# Altium project SoldeerBout.PrjPcb
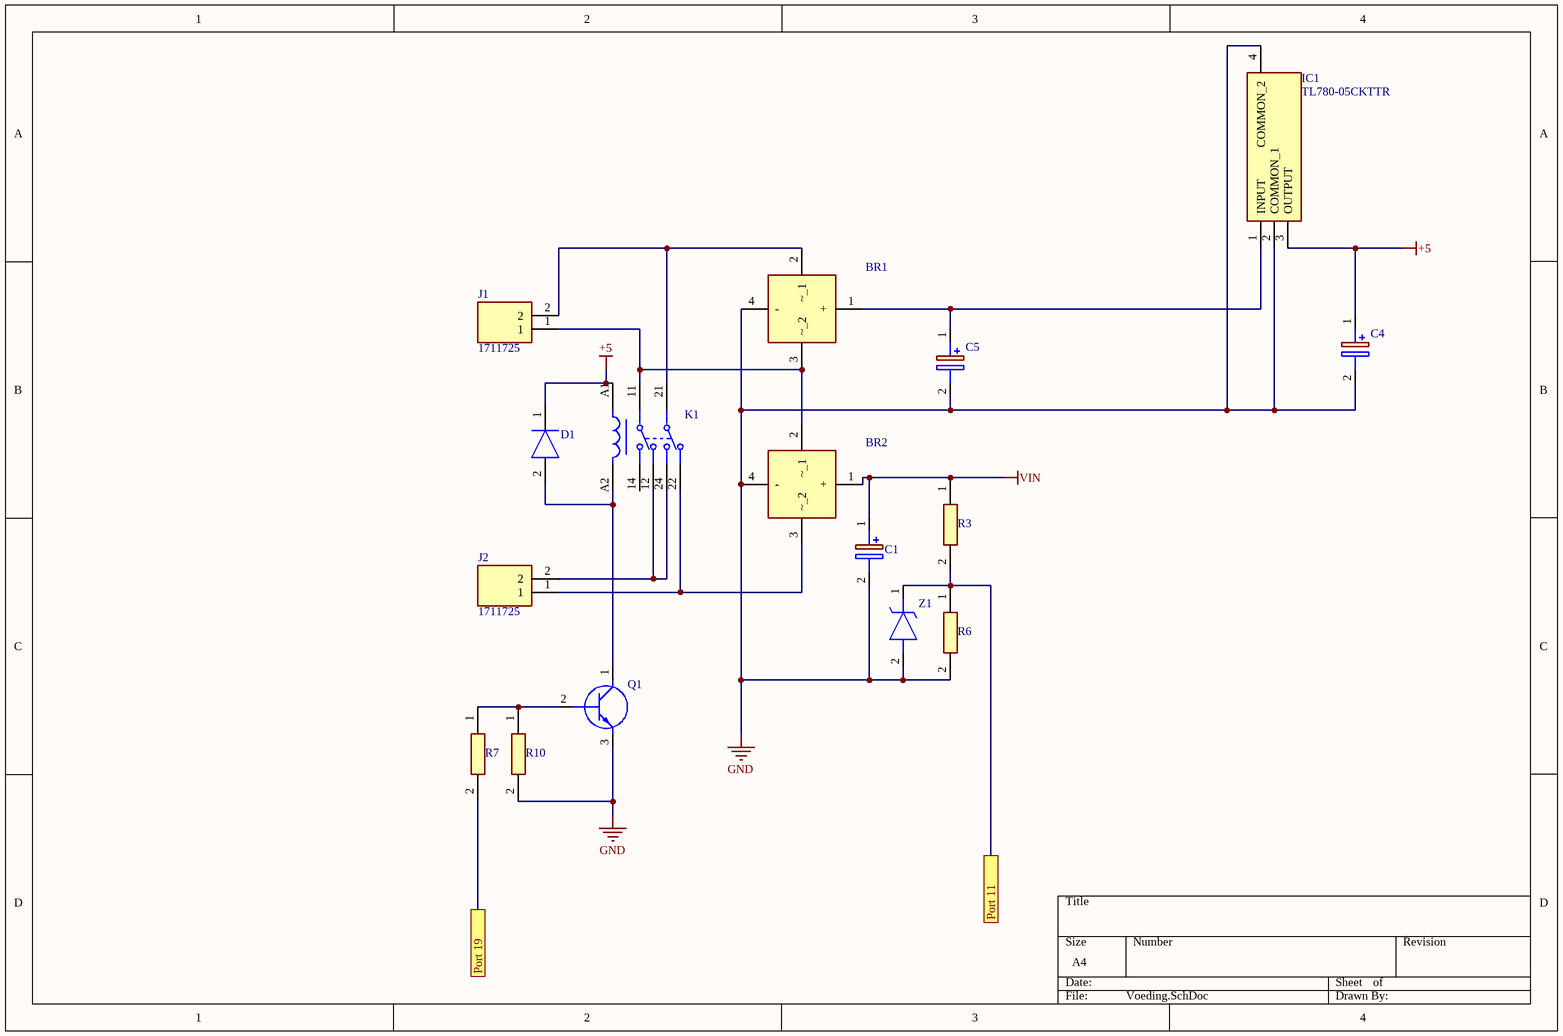
[diagram p0: Voeding.SchDoc]
5 sheets, 76 parts. Net scope: flat (ports and power ports of the same name join across sheets).
Board files: beter.PcbDoc, test.PcbDoc, goodPCB.PcbDoc
Sheets:
  Voeding.SchDoc
  Processor.SchDoc
  Opamp.SchDoc
  Display.SchDoc
  BoutVoeding.SchDoc

## Sheet Voeding.SchDoc
size A4; SheetNumber: 1; SheetTotal: 5

### Parts
BR1  GBU6J-E3_45  [Bridge rectifier]  (value not drawn)
BR2  GBU6J-E3_45  [Bridge rectifier]  (value not drawn)
C1  ESK478M050AQ3AA  [4700µF 50V]  (value not drawn)
C4  EEU-FR1H100  [10µF 50V]  (value not drawn)
C5  EEU-FR1H100  [100µF]  (value not drawn)
D1  1N4007G-T  [D1]  (value not drawn)
IC1  TL780-05CKTTR  [IC1]
J1  1711725  [Phoenix]
J2  1711725  [Phoenix]
K1  RT424615  [FP-RT424615-MFG]  (value not drawn)
Q1  BC547CBU  [TTTT]  (value not drawn)
R3  CRCW080510K0DHEAP  [Resistor]  (value not drawn)
R6  CRCW080510K0DHEAP  [Resistor]  (value not drawn)
R7  CRCW080510K0DHEAP  [Resistor]  (value not drawn)
R10  CRCW08054K70FKEAHP  [Resistor]  (value not drawn)
Z1  SZMMSZ5231BT1G  [Zener]  (value not drawn)

### Ports
Port 11, Port 19

### Nets
+5: C4.1(+) D1.1(K) IC1.3(OUTPUT) K1.A1
GND: BR1.4(-) BR2.4(-) C1.2(-) C4.2(-) C5.2(-) IC1.2(COMMON_1) IC1.4(COMMON_2) Q1.3(E) R6.2 R10.2 Z1.2(A)
VIN: BR2.1(+) C1.1(+) R3.1
NetBR1_1: BR1.1(+) C5.1(+) IC1.1(INPUT)
NetBR1_2: BR1.2(~_1) J1.2 K1.21
NetBR1_3: BR1.3(~_2) BR2.2(~_1) J1.1 K1.11
NetBR2_3: BR2.3(~_2) J2.1 K1.22
NetD1_2: D1.2(A) K1.A2 Q1.1(C)
NetIC3_11: R3.2 R6.1 Z1.1(K) ; port Port 11
NetIC3_19: R7.2 ; port Port 19
NetJ2_2: J2.2 K1.12 K1.24
NetQ1_2: Q1.2(B) R7.1 R10.1

Not connected (* = marked no-connect by the designer): K1 14

### Library data of the parts
BR1 BR2 = GBU6J-E3_45: Bridge Rectifier; Manufacturer_Name: Vishay; Manufacturer_Part_Number: GBU6J-E3/45; Datasheet Link: http://www.vishay.com/docs/88615/gbu6a.pdf; Height: 18.8mm
C1 = ESK478M050AQ3AA: Capacitor Polarised 50V 4700uF; Manufacturer_Name: Kemet; Datasheet Link: https://componentsearchengine.com//ESK478M050AQ3AA.pdf; Height: 37mm; Mouser2 Part Number: 80-ESK478M050AQ3AA; Mouser2 Price/Stock: https://www.mouser.com/Search/Refine.aspx?Keyword=80-ESK478M050AQ3AA; Manufacturer_Part_Number: ESK478M050AQ3AA
C4 C5 = EEU-FR1H100: Capacitor Polarised 50VDC 10uF; Manufacturer_Name: Panasonic; Datasheet Link: https://componentsearchengine.com//EEU-FR1H100.pdf; Height: 12.5mm; Mouser2 Part Number: 667-EEU-FR1H100; Mouser2 Price/Stock: https://www.mouser.com/Search/Refine.aspx?Keyword=667-EEU-FR1H100; Manufacturer_Part_Number: EEU-FR1H100
D1 = 1N4007G-T: Diode; Manufacturer_Name: Diodes Inc.; Datasheet Link: https://componentsearchengine.com//1N4007G-T.pdf; Mouser2 Part Number: 621-1N4007G-T; Mouser2 Price/Stock: https://www.mouser.com/Search/Refine.aspx?Keyword=621-1N4007G-T; Manufacturer_Part_Number: 1N4007G-T
IC1 = TL780-05CKTTR: Integrated Circuit; Manufacturer_Name: Texas Instruments; Datasheet Link: http://www.ti.com/general/docs/suppproductinfo.tsp?distId=26&gotoUrl=http%3A%2F%2Fwww.ti.com%2Flit%2Fgpn%2Ftl780; Height: 5.08mm; Manufacturer_Part_Number: TL780-05CKTTR
J1 J2 = 1711725: Connector; Manufacturer_Name: Phoenix Contact; Datasheet Link: http://www.phoenixcontact.com/de/produkte/1711725/pdf; Height: 18.2mm; Manufacturer_Part_Number: 1711725
K1 = CMP-03395-000241-1: RELAY GEN PURPOSE DPDT 8A 115V; Max Current Rating: 15A; Ratings: IP54; Coil Type: Non-Latching; Power Rating: 760mW; Max Voltage Rating (AC): 400V; Coil Resistance: 8.1kR; Operate Time: 8ms; Approvals: CSA; Application(s): POWER; Relay Type: General Purpose; Switching Capacity: 2kW; Length: 29mm; Switching Current: 8A; Mount: Through Hole; Contact Current Rating: 8A; Coil Voltage (AC): 115V; Voltage Rating (AC): 400V; Width: 12.7mm; Radiation Hardening: No; Case/Package: DIP; Current Rating: 8A; Number of Pins: 8; Height: 15.7mm; Series: RT2, SCHRACK; Throw Configuration: DPDT; Packaging: Rail/Tube; Package Quantity: 500; Min Operating Temperature: -40°C; Termination: PC Pin; RoHS Compliant: Yes; Depth: 12.7mm; Max Operating Temperature: 70°C; Contact Material: Silver
Q1 = BC547CBU: Transistor BJT NPN; Manufacturer_Name: ON Semiconductor; Datasheet Link: https://www.onsemi.com/pdf/datasheet/bc550-d.pdf; Height: 5.33mm; Manufacturer_Part_Number: BC547CBU
R3 = CRCW080510K0DHEAP: Resistor 68KOhm; Manufacturer_Name: Vishay; Datasheet Link: https://www.arrow.com/en/products/crcw080510k0dheap/vishay; Height: 0.5mm; Manufacturer_Part_Number: CRCW080510K0DHEAP
R6 R7 = CRCW080510K0DHEAP: Resistor 10KOhm; Manufacturer_Name: Vishay; Datasheet Link: https://www.arrow.com/en/products/crcw080510k0dheap/vishay; Height: 0.5mm; Manufacturer_Part_Number: CRCW080510K0DHEAP
R10 = CRCW08054K70FKEAHP: Resistor 4.7KOhm; Manufacturer_Name: Vishay; Datasheet Link: https://componentsearchengine.com//CRCW08054K70FKEAHP.pdf; Height: 0.5mm; Mouser2 Part Number: 71-CRCW08054K70FKEAH; Mouser2 Price/Stock: https://www.mouser.com/Search/Refine.aspx?Keyword=71-CRCW08054K70FKEAH; Manufacturer_Part_Number: CRCW08054K70FKEAHP
Z1 = SZMMSZ5231BT1G: Zener Diode; Manufacturer_Name: ON Semiconductor; Datasheet Link: https://componentsearchengine.com//SZMMSZ5231BT1G.pdf; Height: 1.35mm; Mouser2 Part Number: 863-SZMMSZ5231BT1G; Mouser2 Price/Stock: https://www.mouser.com/Search/Refine.aspx?Keyword=863-SZMMSZ5231BT1G; Manufacturer_Part_Number: SZMMSZ5231BT1G

## Sheet Processor.SchDoc
size A4; SheetNumber: 2; SheetTotal: 5
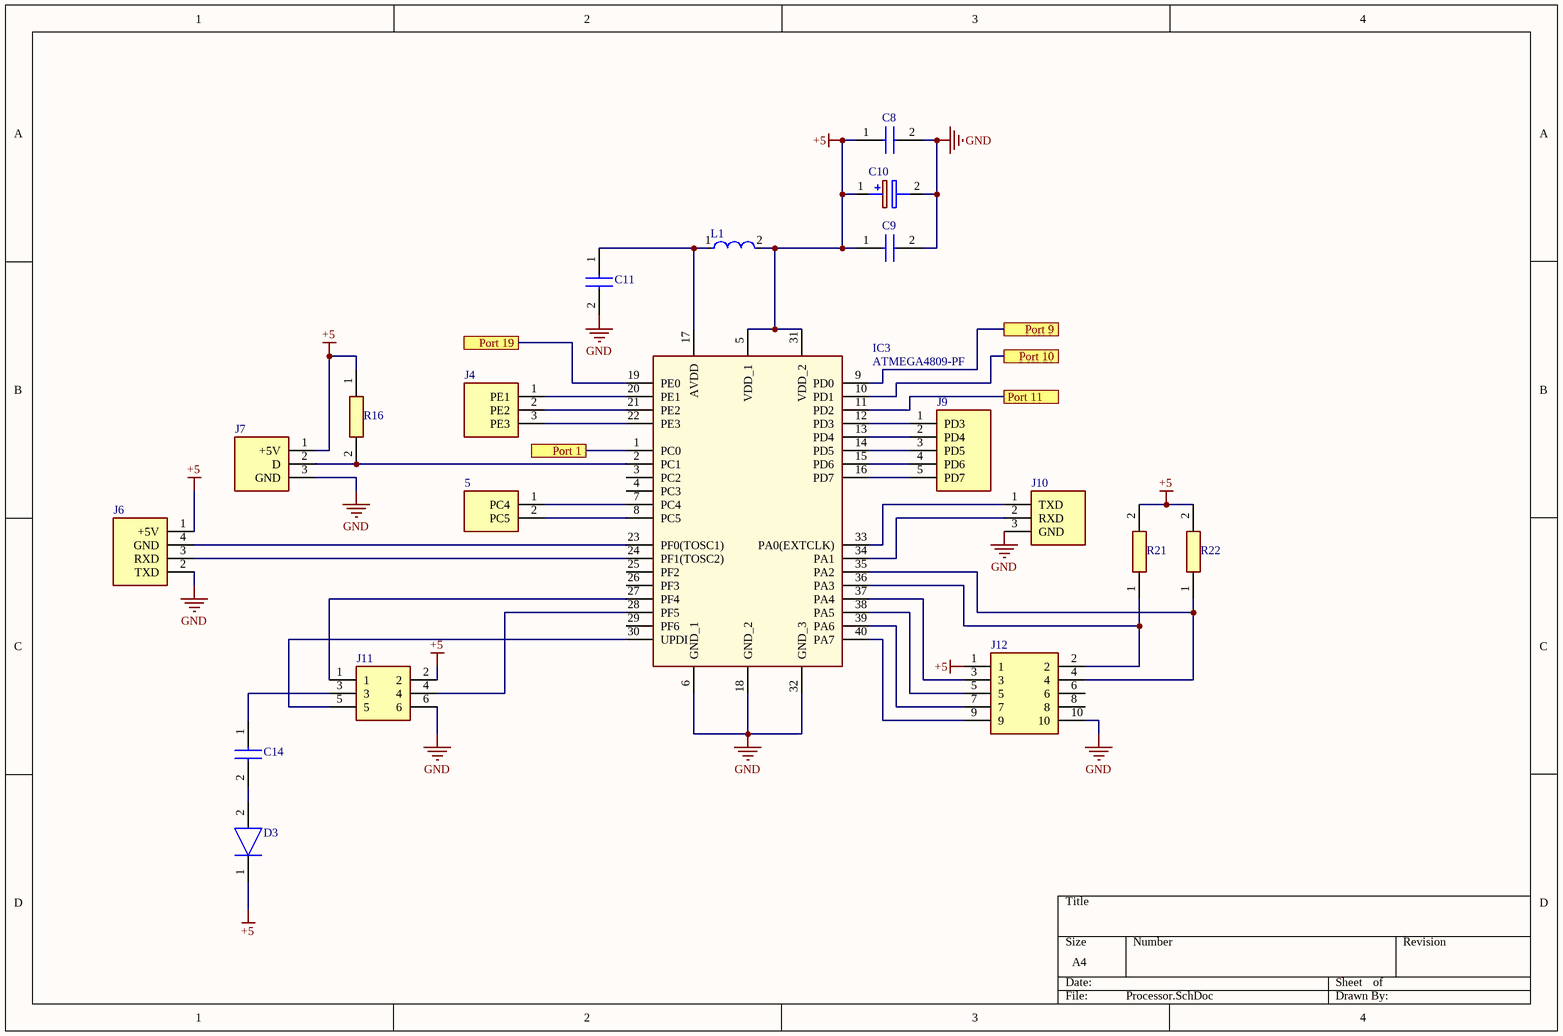
[diagram p1: Processor.SchDoc]

### Parts
5  1711725  [1711725]  (value not drawn)
C8  C0805C104K5RAC7411  [100nF]  (value not drawn)
C9  C0805C104K5RAC7411  [100nF]  (value not drawn)
C10  EEU-FR1H100  [10µF 50V]  (value not drawn)
C11  C0805C104K5RAC7411  [100nF]  (value not drawn)
C14  C0805C104K5RAC7411  [100nF]  (value not drawn)
D3  1N4148WS_R1_00001  [SODFL2512X95N]  (value not drawn)
IC3  ATMEGA4809-PF  [DIP1543W58P254L5175H635Q40N]
J4  10129378-903001BLF  [HDRV3W67P0X254_1X3_762X241X858P]  (value not drawn)
J6  10129378-904001BLF  [HDRV4W67P0X254_1X4_1270X241X858P]  (value not drawn)
J7  10129378-903001BLF  [HDRV3W67P0X254_1X3_762X241X858P]  (value not drawn)
J9  10129378-905001BLF  [HDRV5W67P0X254_1X5_1270X241X858P]  (value not drawn)
J10  10129378-903001BLF  [HDRV3W67P0X254_1X3_762X241X858P]  (value not drawn)
J11  10129381-906002BLF  [HDRV6W67P254_2X3_762X483X858P]  (value not drawn)
J12  N2510-6002RB  [1PinBox]  (value not drawn)
L1  CBC3225T100MR  [FP-CB3225-IPC_A]  (value not drawn)
R16  CRCW08054K70FKEAHP  [RESC2012X50N]  (value not drawn)
R21  CRCW08054K70FKEAHP  [RESC2012X50N]  (value not drawn)
R22  CRCW08054K70FKEAHP  [RESC2012X50N]  (value not drawn)

### Ports
Port 1, Port 9, Port 10, Port 11, Port 19

### Nets
+5: C8.1 C9.1 C10.1(+) D3.1(K) IC3.5(VDD_1) IC3.31(VDD_2) J6.1(+5V) J7.1(+5V) J11.2 J12.1 L1.2 R16.1 R21.2 R22.2
GND: C8.2 C9.2 C10.2(-) C11.2 IC3.6(GND_1) IC3.18(GND_2) IC3.32(GND_3) J6.2(TXD) J7.3(GND) J10.3(GND) J11.6 J12.10
Net5_1: 5.1(PC4) IC3.7(PC4)
Net5_2: 5.2(PC5) IC3.8(PC5)
NetC6_1: IC3.9(PD0) ; port Port 9
NetC11_1: C11.1 IC3.17(AVDD) L1.1
NetC12_1: IC3.10(PD1) ; port Port 10
NetC14_1: C14.1 J11.3
NetC14_2: C14.2 D3.2(A)
NetIC3_1: IC3.1(PC0) ; port Port 1
NetIC3_2: IC3.2(PC1) J7.2(D) R16.2
NetIC3_11: IC3.11(PD2) ; port Port 11
NetIC3_12: IC3.12(PD3) J9.1(PD3)
NetIC3_13: IC3.13(PD4) J9.2(PD4)
NetIC3_14: IC3.14(PD5) J9.3(PD5)
NetIC3_15: IC3.15(PD6) J9.4(PD6)
NetIC3_16: IC3.16(PD7) J9.5(PD7)
NetIC3_19: IC3.19(PE0) ; port Port 19
NetIC3_20: IC3.20(PE1) J4.1(PE1)
NetIC3_21: IC3.21(PE2) J4.2(PE2)
NetIC3_22: IC3.22(PE3) J4.3(PE3)
NetIC3_23: IC3.23(PF0(TOSC1)) J6.4(GND)
NetIC3_24: IC3.24(PF1(TOSC2)) J6.3(RXD)
NetIC3_27: IC3.27(PF4) J11.1
NetIC3_28: IC3.28(PF5) J11.4
NetIC3_30: IC3.30(UPDI) J11.5
NetIC3_33: IC3.33(PA0(EXTCLK)) J10.1(TXD)
NetIC3_34: IC3.34(PA1) J10.2(RXD)
NetIC3_35: IC3.35(PA2) J12.4 R22.1
NetIC3_36: IC3.36(PA3) J12.2 R21.1
NetIC3_37: IC3.37(PA4) J12.3
NetIC3_38: IC3.38(PA5) J12.5
NetIC3_39: IC3.39(PA6) J12.7
NetIC3_40: IC3.40(PA7) J12.9

Not connected (* = marked no-connect by the designer): IC3 3(PC2) 4(PC3) 25(PF2) 26(PF3) 29(PF6); J12 6 8

### Library data of the parts
5 = 1711725: as J1 on sheet Voeding; Datasheet Link: http://www.phoenixcontact.com/de/produkte/1711725/pdf; Height: 18.2mm; Manufacturer_Part_Number: 1711725
C8 C9 C11 C14 = C0805C104K5RAC7411: Capacitor  0.1 uF 50VDC; Manufacturer_Name: Kemet; Datasheet Link: https://componentsearchengine.com//C0805C104K5RAC7411.pdf; Height: 0.88mm; Mouser2 Part Number: 80-C0805C104K5RACLR; Mouser2 Price/Stock: https://www.mouser.com/Search/Refine.aspx?Keyword=80-C0805C104K5RACLR; Manufacturer_Part_Number: C0805C104K5RAC7411
C10 = EEU-FR1H100: as C4 on sheet Voeding; Datasheet Link: https://componentsearchengine.com//EEU-FR1H100.pdf; Height: 12.5mm; Mouser2 Part Number: 667-EEU-FR1H100; Mouser2 Price/Stock: https://www.mouser.com/Search/Refine.aspx?Keyword=667-EEU-FR1H100; Manufacturer_Part_Number: EEU-FR1H100
D3 = 1N4148WS_R1_00001: Diode; Manufacturer_Name: PANJIT; Datasheet Link: https://www.mouser.it/datasheet/2/1057/1N4148WS-1869723.pdf; Height: 0.95mm; Manufacturer_Part_Number: 1N4148WS_R1_00001
IC3 = ATMEGA4809-PF: Integrated Circuit; Manufacturer_Name: Microchip; Datasheet Link: https://componentsearchengine.com//ATMEGA4809-PF.pdf; Height: 6.35mm; Mouser2 Part Number: 556-ATMEGA4809-PF; Mouser2 Price/Stock: https://www.mouser.com/Search/Refine.aspx?Keyword=556-ATMEGA4809-PF; Manufacturer_Part_Number: ATMEGA4809-PF
J4 J7 J10 = 10129378-903001BLF: Connector; Manufacturer_Name: Amphenol; Height: 8.58mm; Manufacturer_Part_Number: 10129378-903001BLF
J6 = 10129378-904001BLF: Connector; Manufacturer_Name: Amphenol; Datasheet Link: https://cdn.amphenol-icc.com/media/wysiwyg/files/drawing/10129378.pdf; Height: 8.58mm; Manufacturer_Part_Number: 10129378-904001BLF
J9 = 10129378-905001BLF: Connector; Manufacturer_Name: FCI Electronics; Datasheet Link: https://cdn.amphenol-icc.com/media/wysiwyg/files/drawing/10129378.pdf; Height: 8.58mm; Manufacturer_Part_Number: 10129378-905001BLF
J11 = 10129381-906002BLF: Connector; Manufacturer_Name: Amphenol; Datasheet Link: https://componentsearchengine.com//10129381-906002BLF.pdf; Height: 8.58mm; Mouser2 Part Number: 649-1012938190602BLF; Mouser2 Price/Stock: https://www.mouser.com/Search/Refine.aspx?Keyword=649-1012938190602BLF; Manufacturer_Part_Number: 10129381-906002BLF
J12 = N2510-6002RB: Connector; Manufacturer_Name: 3M; Datasheet Link: https://componentsearchengine.com//N2510-6002RB.pdf; Height: 9.91mm; Mouser2 Part Number: 517-N2510-6002RB; Mouser2 Price/Stock: https://www.mouser.com/Search/Refine.aspx?Keyword=517-N2510-6002RB; Manufacturer_Part_Number: N2510-6002RB
L1 = CMP-14484-000123-1: SMD Inductors 10uH ±20% 0.9A 0.1729Ω 1210; Shielding: Unshielded; DC Resistance (DCR): 172.9mR; Core Material: Ferrite; Self Resonant Frequency: 23MHz; Max DC Current: 900mA; Test Frequency: 100kHz; Package Quantity: 1000; Military Standard: Not; Inductance: 10uH; Height: 2.5mm; Case Code (Metric): 3225; Width: 0.098inch; Case Code (Imperial): 1210; Inductance Tolerance: 20%; Lead Free: Lead Free; Length: 3.4mm; Max Operating Temperature: 105°C; Resistor Type: Wirewound; Height - Seated (Max): 0.106inch; Series: CB; Packaging: Tape and Reel; Depth: 2.7mm; Number of Pins: 2; Radiation Hardening: No; Tolerance: 20%; Case/Package: 1210; Mount: Surface Mount; Saturation Current: 900mA; Min Operating Temperature: -40°C; DC Current: 900mA; Current Rating: 900mA; Halogen Free: Halogen Free; Termination: SMD/SMT
R16 R21 R22 = CRCW08054K70FKEAHP: as R10 on sheet Voeding; Datasheet Link: https://componentsearchengine.com//CRCW08054K70FKEAHP.pdf; Height: 0.5mm; Mouser2 Part Number: 71-CRCW08054K70FKEAH; Mouser2 Price/Stock: https://www.mouser.com/Search/Refine.aspx?Keyword=71-CRCW08054K70FKEAH; Manufacturer_Part_Number: CRCW08054K70FKEAHP

## Sheet Opamp.SchDoc
size A4; SheetNumber: 3; SheetTotal: 5
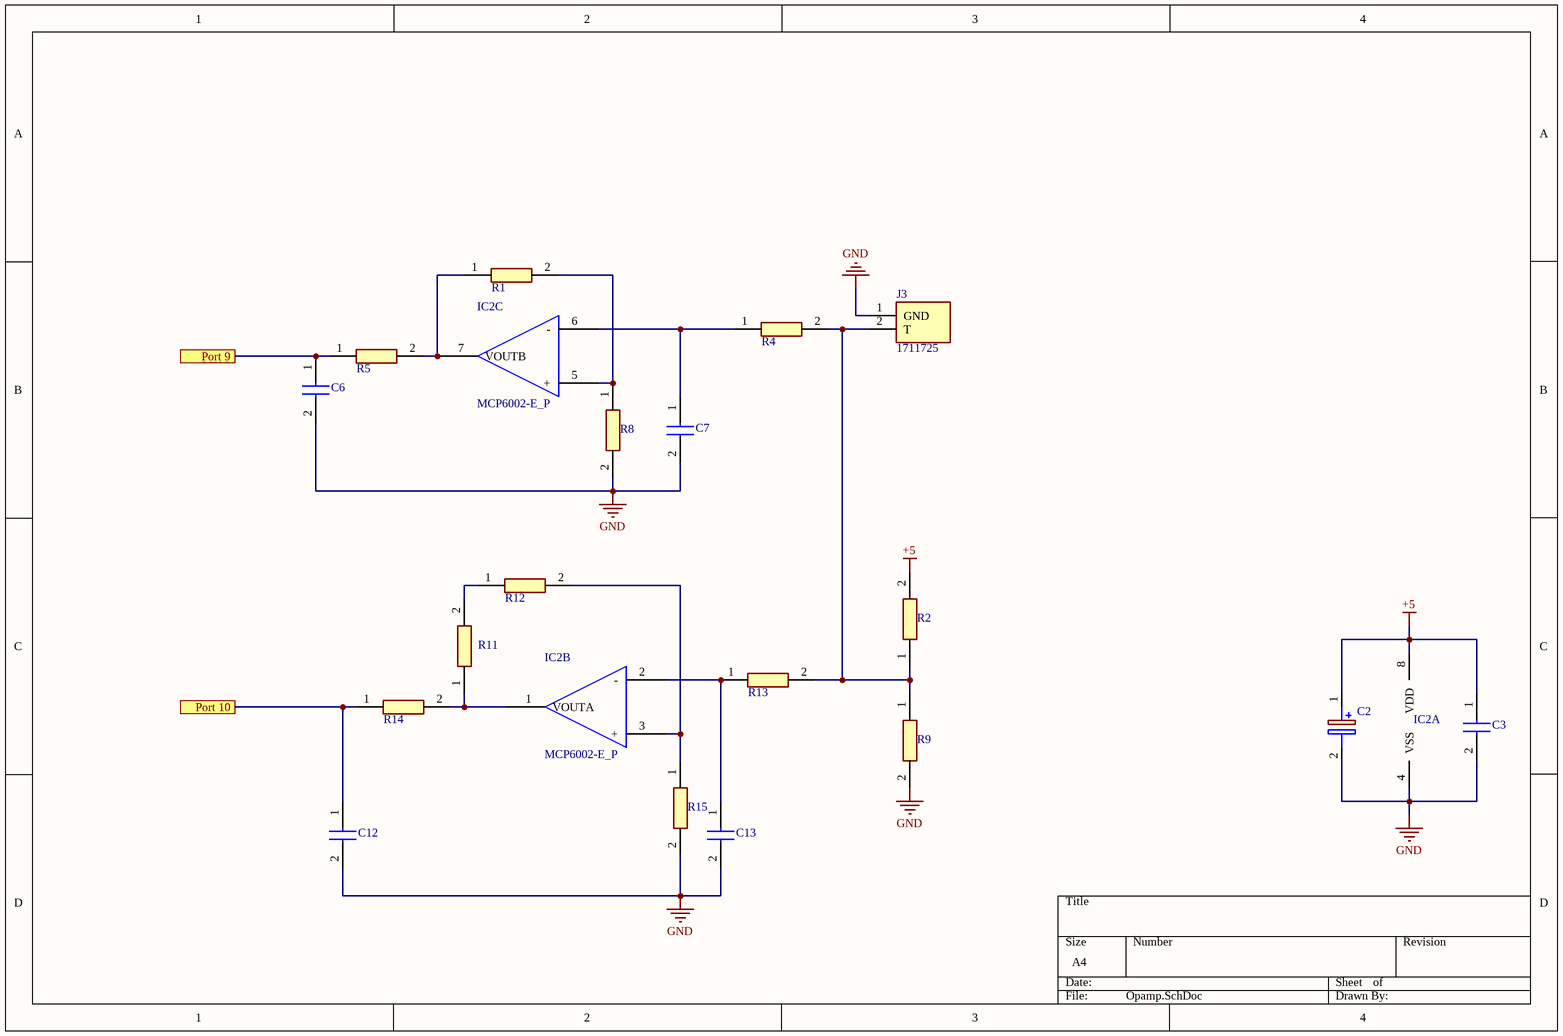
[diagram p2: Opamp.SchDoc]

### Parts
C2  EEU-FR1H100  [10µF 50V]  (value not drawn)
C3  C0805C104K5RAC7411  [100nF]  (value not drawn)
C6  C0805C103K5TACAUTO  [10nF]  (value not drawn)
C7  C0805C103K5TACAUTO  [10nF]  (value not drawn)
C12  C0805C103K5TACAUTO  [10nF]  (value not drawn)
C13  C0805C103K5TACAUTO  [10nF]  (value not drawn)
IC2  MCP6002-E_P  [DIP781W56P254L950H533Q8N]  (value not drawn)  (parts A,B,C of 3)
J3  1711725  [1711725]
R1  CRCW080510K0DHEAP  [Resistor]  (value not drawn)
R2  CR0805-JW-105ELF  [Resistor]  (value not drawn)
R4  CRCW08055K60FKTA  [Resistor]  (value not drawn)
R5  CRCW08055K60FKTA  [Resistor]  (value not drawn)
R8  CPF0805B18KE  [Resistor]  (value not drawn)
R9  CR0805-JW-105ELF  [Resistor]  (value not drawn)
R11  CRCW080510K0DHEAP  [Resistor]  (value not drawn)
R12  CRCW080510K0DHEAP  [Resistor]  (value not drawn)
R13  CRCW08055K60FKTA  [Resistor]  (value not drawn)
R14  CRCW08055K60FKTA  [Resistor]  (value not drawn)
R15  CPF0805B18KE  [Resistor]  (value not drawn)

### Ports
Port 9, Port 10

### Nets
+5: C2.1(+) C3.1 IC2.8(VDD) R2.2
GND: C2.2(-) C3.2 C6.2 C7.2 C12.2 C13.2 IC2.4(VSS) J3.1(GND) R8.2 R9.2 R15.2
NetC6_1: C6.1 R5.1 ; port Port 9
NetC7_1: C7.1 IC2.6(-) R4.1
NetC12_1: C12.1 R14.1 ; port Port 10
NetC13_1: C13.1 IC2.2(-) R13.1
NetIC2_1: IC2.1(VOUTA) R11.1 R14.2
NetIC2_3: IC2.3(+) R12.2 R15.1
NetIC2_5: IC2.5(+) R1.2 R8.1
NetIC2_7: IC2.7(VOUTB) R1.1 R5.2
NetJ3_2: J3.2(T) R2.1 R4.2 R9.1 R13.2
NetR11_2: R11.2 R12.1

### Library data of the parts
C2 = EEU-FR1H100: as C4 on sheet Voeding; Datasheet Link: https://componentsearchengine.com//EEU-FR1H100.pdf; Height: 12.5mm; Mouser2 Part Number: 667-EEU-FR1H100; Mouser2 Price/Stock: https://www.mouser.com/Search/Refine.aspx?Keyword=667-EEU-FR1H100; Manufacturer_Part_Number: EEU-FR1H100
C3 = C0805C104K5RAC7411: as C8 on sheet Processor; Datasheet Link: https://componentsearchengine.com//C0805C104K5RAC7411.pdf; Height: 0.88mm; Mouser2 Part Number: 80-C0805C104K5RACLR; Mouser2 Price/Stock: https://www.mouser.com/Search/Refine.aspx?Keyword=80-C0805C104K5RACLR; Manufacturer_Part_Number: C0805C104K5RAC7411
C6 C7 C12 C13 = C0805C103K5TACAUTO: Capacitor 0.01µF 50VDC; Manufacturer_Name: Kemet; Height: 0.88mm; Manufacturer_Part_Number: C0805C103K5TACAUTO
IC2 = MCP6002-E_P: Integrated Circuit, opamp; Manufacturer_Name: Microchip; Manufacturer_Part_Number: MCP6002-E/P; Datasheet Link: https://componentsearchengine.com//MCP6002-E_P.pdf; Height: 5.334mm; Mouser2 Part Number: 579-MCP6002-E/P; Mouser2 Price/Stock: https://www.mouser.com/Search/Refine.aspx?Keyword=579-MCP6002-E%2FP
J3 = 1711725: as J1 on sheet Voeding; Datasheet Link: http://www.phoenixcontact.com/de/produkte/1711725/pdf; Height: 18.2mm; Manufacturer_Part_Number: 1711725
R1 R11 R12 = CRCW080510K0DHEAP: as R6 on sheet Voeding; Datasheet Link: https://www.arrow.com/en/products/crcw080510k0dheap/vishay; Height: 0.5mm; Manufacturer_Part_Number: CRCW080510K0DHEAP
R2 R9 = CR0805-JW-105ELF: Resistor 1MOhm; Manufacturer_Name: Bourns; Datasheet Link: https://www.bourns.com/pdfs/chpreztr.pdf; Height: 0.6mm; Manufacturer_Part_Number: CR0805-JW-105ELF
R4 R5 R13 R14 = CRCW08055K60FKTA: Resistor 5.6KOhm; Manufacturer_Name: Vishay; Datasheet Link: http://www.vishay.com/docs/20035/dcrcwe3.pdf; Height: 0.5mm; Manufacturer_Part_Number: CRCW08055K60FKTA
R8 R15 = CPF0805B18KE: Resistor 510Ohm; Manufacturer_Name: TE Connectivity; Datasheet Link: https://datasheet.datasheetarchive.com/originals/distributors/DKDS-21/401696.pdf; Height: 0.65mm; Manufacturer_Part_Number: CPF0805B18KE

## Sheet Display.SchDoc
size A4; SheetNumber: 4; SheetTotal: 5
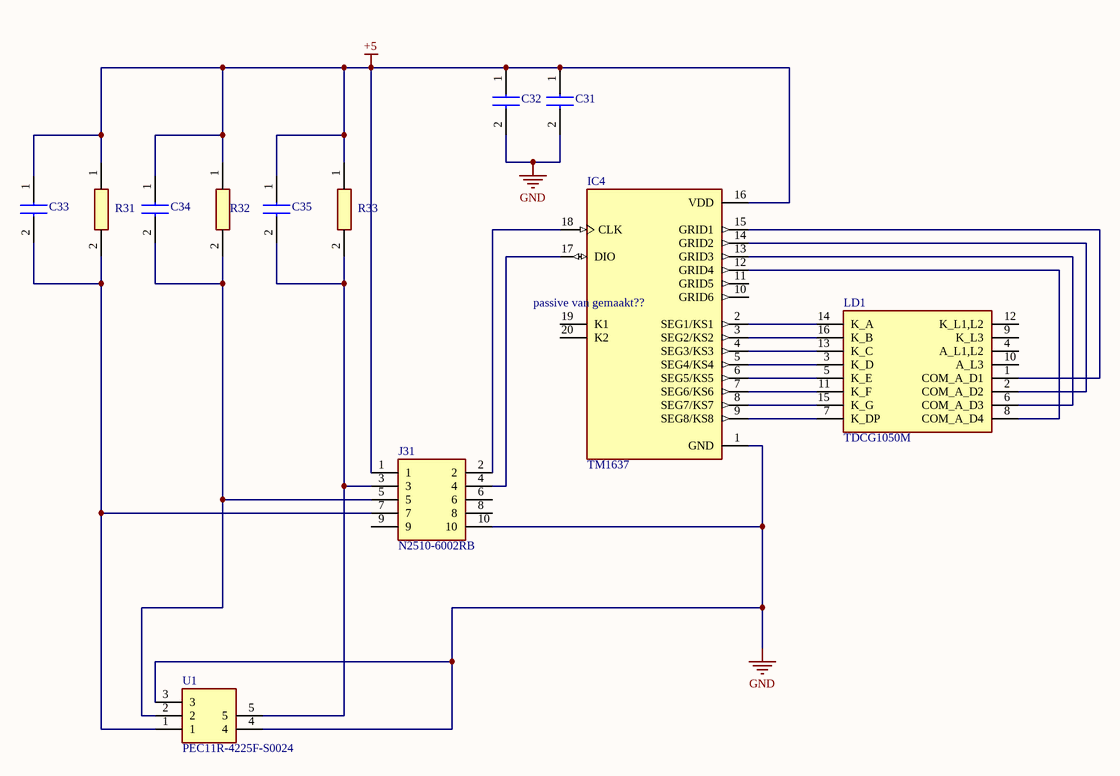
[diagram p3: Display.SchDoc]

### Parts
C31  C0805C104K5RAC7411  [100nF]  (value not drawn)
C32  C0805C104K5RAC7411  [100nF]  (value not drawn)
C33  C0805C103K5TACAUTO  [10nF]  (value not drawn)
C34  C0805C103K5TACAUTO  [10nF]  (value not drawn)
C35  C0805C103K5TACAUTO  [10nF]  (value not drawn)
IC4  TM1637  [DisplayIC]
J31  N2510-6002RB  [SHDR10W64P254_2X5_2002X859X991P]
LD1  TDCG1050M  [Display]
R31  CRCW080510K0DHEAP  [Resistor]  (value not drawn)
R32  CRCW080510K0DHEAP  [Resistor]  (value not drawn)
R33  CRCW080510K0DHEAP  [Resistor]  (value not drawn)
U1  PEC11R-4225F-S0024  [PEC12R-4XXXF-SXXXX_1]

### Nets
+5: C31.1 C32.1 C33.1 C34.1 C35.1 IC4.16(VDD) J31.1 R31.1 R32.1 R33.1
GND: C31.2 C32.2 IC4.1(GND) J31.10 U1.3 U1.4
NetC33_2: C33.2 J31.7 R31.2 U1.1
NetC34_2: C34.2 J31.5 R32.2 U1.2
NetC35_2: C35.2 J31.3 R33.2 U1.5
NetIC4_2: IC4.2(SEG1/KS1) LD1.14(K_A)
NetIC4_3: IC4.3(SEG2/KS2) LD1.16(K_B)
NetIC4_4: IC4.4(SEG3/KS3) LD1.13(K_C)
NetIC4_5: IC4.5(SEG4/KS4) LD1.3(K_D)
NetIC4_6: IC4.6(SEG5/KS5) LD1.5(K_E)
NetIC4_7: IC4.7(SEG6/KS6) LD1.11(K_F)
NetIC4_8: IC4.8(SEG7/KS7) LD1.15(K_G)
NetIC4_9: IC4.9(SEG8/KS8) LD1.7(K_DP)
NetIC4_12: IC4.12(GRID4) LD1.8(COM_A_D4)
NetIC4_13: IC4.13(GRID3) LD1.6(COM_A_D3)
NetIC4_14: IC4.14(GRID2) LD1.2(COM_A_D2)
NetIC4_15: IC4.15(GRID1) LD1.1(COM_A_D1)
NetIC4_17: IC4.17(DIO) J31.4
NetIC4_18: IC4.18(CLK) J31.2

Not connected (* = marked no-connect by the designer): IC4 10(GRID6) 11(GRID5) 19(K1) 20(K2); J31 6 8 9; LD1 4(A_L1,L2) 9(K_L3) 10(A_L3) 12(K_L1,L2)

### Notes on the sheet
- (near IC4) passive van gemaakt??

### Library data of the parts
C31 = C0805C104K5RAC7411: Capacitor  100 uF 50VDC; Manufacturer_Name: Kemet; Datasheet Link: https://componentsearchengine.com//C0805C104K5RAC7411.pdf; Height: 0.88mm; Mouser2 Part Number: 80-C0805C104K5RACLR; Mouser2 Price/Stock: https://www.mouser.com/Search/Refine.aspx?Keyword=80-C0805C104K5RACLR; Manufacturer_Part_Number: C0805C104K5RAC7411
C32 = C0805C104K5RAC7411: as C8 on sheet Processor; Datasheet Link: https://componentsearchengine.com//C0805C104K5RAC7411.pdf; Height: 0.88mm; Mouser2 Part Number: 80-C0805C104K5RACLR; Mouser2 Price/Stock: https://www.mouser.com/Search/Refine.aspx?Keyword=80-C0805C104K5RACLR; Manufacturer_Part_Number: C0805C104K5RAC7411
C33-C35 = C0805C103K5TACAUTO: as C6 on sheet Opamp; Height: 0.88mm; Manufacturer_Part_Number: C0805C103K5TACAUTO
IC4 = TM1637: LED Drive Control Special Circuit; MF: Titan Micro Electronics; Package: Package; Availability: Not in stock; SnapEDA_Link: https://www.snapeda.com/parts/TM1637/Titan+Micro+Electronics/view-part/?ref=snap; MP: TM1637; Check_prices: https://www.snapeda.com/parts/TM1637/Titan+Micro+Electronics/view-part/?ref=eda; Value: *; Price: None
J31 = N2510-6002RB: Connector; Manufacturer_Name: 3M; Datasheet Link: https://componentsearchengine.com//N2510-6002RB.pdf; Height: 9.91mm; Mouser2 Part Number: 517-N2510-6002RB; Mouser2 Price/Stock: https://www.mouser.com/Search/Refine.aspx?Keyword=517-N2510-6002RB; Manufacturer_Part_Number: N2510-6002RB
LD1 = TDCG1050M: Display; Manufacturer_Name: Vishay; Datasheet Link: https://componentsearchengine.com//TDCG1050M.pdf; Height: 7.25mm; Mouser2 Part Number: 78-TDCG1050; Mouser2 Price/Stock: https://www.mouser.com/Search/Refine.aspx?Keyword=78-TDCG1050; Manufacturer_Part_Number: TDCG1050M
R31-R33 = CRCW080510K0DHEAP: as R6 on sheet Voeding; Datasheet Link: https://www.arrow.com/en/products/crcw080510k0dheap/vishay; Height: 0.5mm; Manufacturer_Part_Number: CRCW080510K0DHEAP
U1 = PEC11R-4225F-S0024: Undefined or Miscellaneous; Manufacturer_Name: Bourns; Datasheet Link: https://componentsearchengine.com//PEC11R-4225F-S0024.pdf; Mouser2 Part Number: 652-PEC11R-4225F-S24; Mouser2 Price/Stock: https://www.mouser.com/Search/Refine.aspx?Keyword=652-PEC11R-4225F-S24; Manufacturer_Part_Number: PEC11R-4225F-S0024

## Sheet BoutVoeding.SchDoc
size A4; SheetNumber: 5; SheetTotal: 5
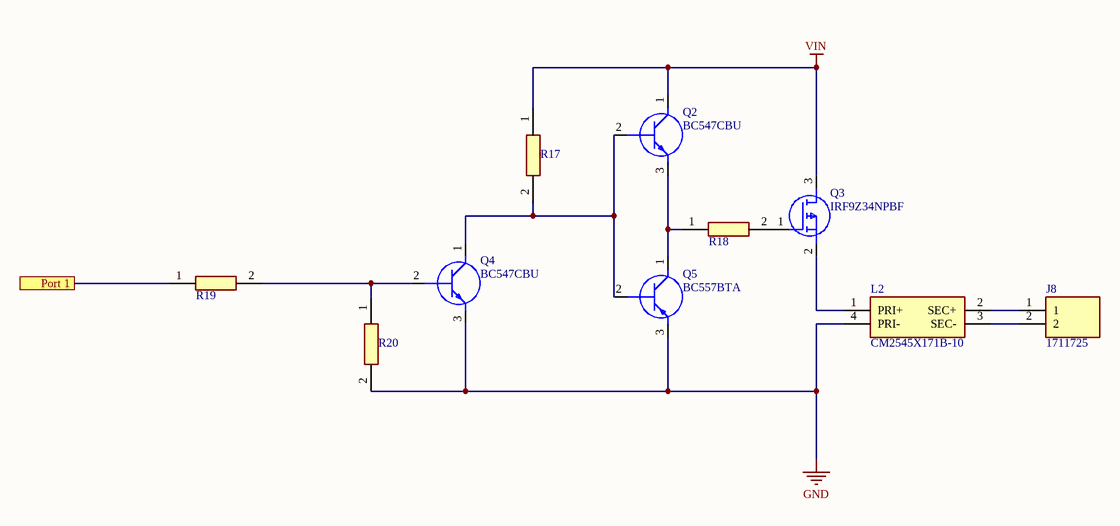
[diagram p4: BoutVoeding.SchDoc]

### Parts
J8  1711725  [1711725]
L2  CM2545X171B-10  [CM2545X171B10]
Q2  BC547CBU  [TTTT]
Q3  IRF9Z34NPBF  [T2]
Q4  BC547CBU  [TTTT]
Q5  BC557BTA  [TTTT]
R17  CRCW08054K70FKEAHP  [Resistor]  (value not drawn)
R18  CPF0805B18KE  [Resistor]  (value not drawn)
R19  CRCW080510K0DHEAP  [Resistor]  (value not drawn)
R20  CRCW08054K70FKEAHP  [Resistor]  (value not drawn)

### Ports
Port 1

### Nets
GND: L2.4(PRI-) Q4.3(E) Q5.3(E) R20.2
VIN: Q2.1(C) Q3.3(D) R17.1
NetIC3_1: R19.1 ; port Port 1
NetJ8_1: J8.1 L2.2(SEC+)
NetJ8_2: J8.2 L2.3(SEC-)
NetL2_1: L2.1(PRI+) Q3.2(S)
NetQ2_2: Q2.2(B) Q4.1(C) Q5.2(B) R17.2
NetQ2_3: Q2.3(E) Q5.1(C) R18.1
NetQ3_1: Q3.1(G) R18.2
NetQ4_2: Q4.2(B) R19.2 R20.1

### Library data of the parts
J8 = 1711725: as J1 on sheet Voeding; Datasheet Link: http://www.phoenixcontact.com/de/produkte/1711725/pdf; Height: 18.2mm; Manufacturer_Part_Number: 1711725
L2 = CM2545X171B-10: Transformer; Manufacturer_Name: Laird Technologies; Datasheet Link: https://datasheet.datasheetarchive.com/originals/dk/DKDS-7/122753.pdf; Height: 9.5mm; Manufacturer_Part_Number: CM2545X171B-10
Q2 Q4 = BC547CBU: as Q1 on sheet Voeding; Datasheet Link: https://www.onsemi.com/pdf/datasheet/bc550-d.pdf; Height: 5.33mm; Manufacturer_Part_Number: BC547CBU
Q3 = IRF9Z34NPBF: MOSFET (P-Channel); Manufacturer_Name: Infineon; Datasheet Link: https://componentsearchengine.com//IRF9Z34NPBF.pdf; Height: 4.69mm; Mouser2 Part Number: 942-IRF9Z34NPBF; Mouser2 Price/Stock: https://www.mouser.com/Search/Refine.aspx?Keyword=942-IRF9Z34NPBF; Manufacturer_Part_Number: IRF9Z34NPBF
Q5 = BC557BTA: Transistor BJT PNP; Manufacturer_Name: ON Semiconductor; Datasheet Link: https://componentsearchengine.com//BC557BTA.pdf; Height: 4.19mm; Mouser2 Part Number: 512-BC557BTA; Mouser2 Price/Stock: https://www.mouser.com/Search/Refine.aspx?Keyword=512-BC557BTA; Manufacturer_Part_Number: BC557BTA
R17 R20 = CRCW08054K70FKEAHP: as R10 on sheet Voeding; Datasheet Link: https://componentsearchengine.com//CRCW08054K70FKEAHP.pdf; Height: 0.5mm; Mouser2 Part Number: 71-CRCW08054K70FKEAH; Mouser2 Price/Stock: https://www.mouser.com/Search/Refine.aspx?Keyword=71-CRCW08054K70FKEAH; Manufacturer_Part_Number: CRCW08054K70FKEAHP
R18 = CPF0805B18KE: Resistor 100Ohm; Manufacturer_Name: TE Connectivity; Datasheet Link: https://datasheet.datasheetarchive.com/originals/distributors/DKDS-21/401696.pdf; Height: 0.65mm; Manufacturer_Part_Number: CPF0805B18KE
R19 = CRCW080510K0DHEAP: as R6 on sheet Voeding; Datasheet Link: https://www.arrow.com/en/products/crcw080510k0dheap/vishay; Height: 0.5mm; Manufacturer_Part_Number: CRCW080510K0DHEAP

## Nets that join several sheets
+5: Voeding (C4.1 D1.1 IC1.3 K1.A1), Processor (14 pins), Opamp (C2.1 C3.1 IC2.8 R2.2), Display (10 pins)
GND: Voeding (11 pins), Processor (12 pins), Opamp (11 pins), Display (6 pins), BoutVoeding (L2.4 Q4.3 Q5.3 R20.2)
VIN: Voeding (BR2.1 C1.1 R3.1), BoutVoeding (Q2.1 Q3.3 R17.1)
NetC6_1: Processor (IC3.9), Opamp (C6.1 R5.1)
NetC12_1: Processor (IC3.10), Opamp (C12.1 R14.1)
NetIC3_1: Processor (IC3.1), BoutVoeding (R19.1)
NetIC3_11: Voeding (R3.2 R6.1 Z1.1), Processor (IC3.11)
NetIC3_19: Voeding (R7.2), Processor (IC3.19)